# Altium schematic sheet 海关全向控制器主控板电路V3_系统管理.SchDoc
size A4
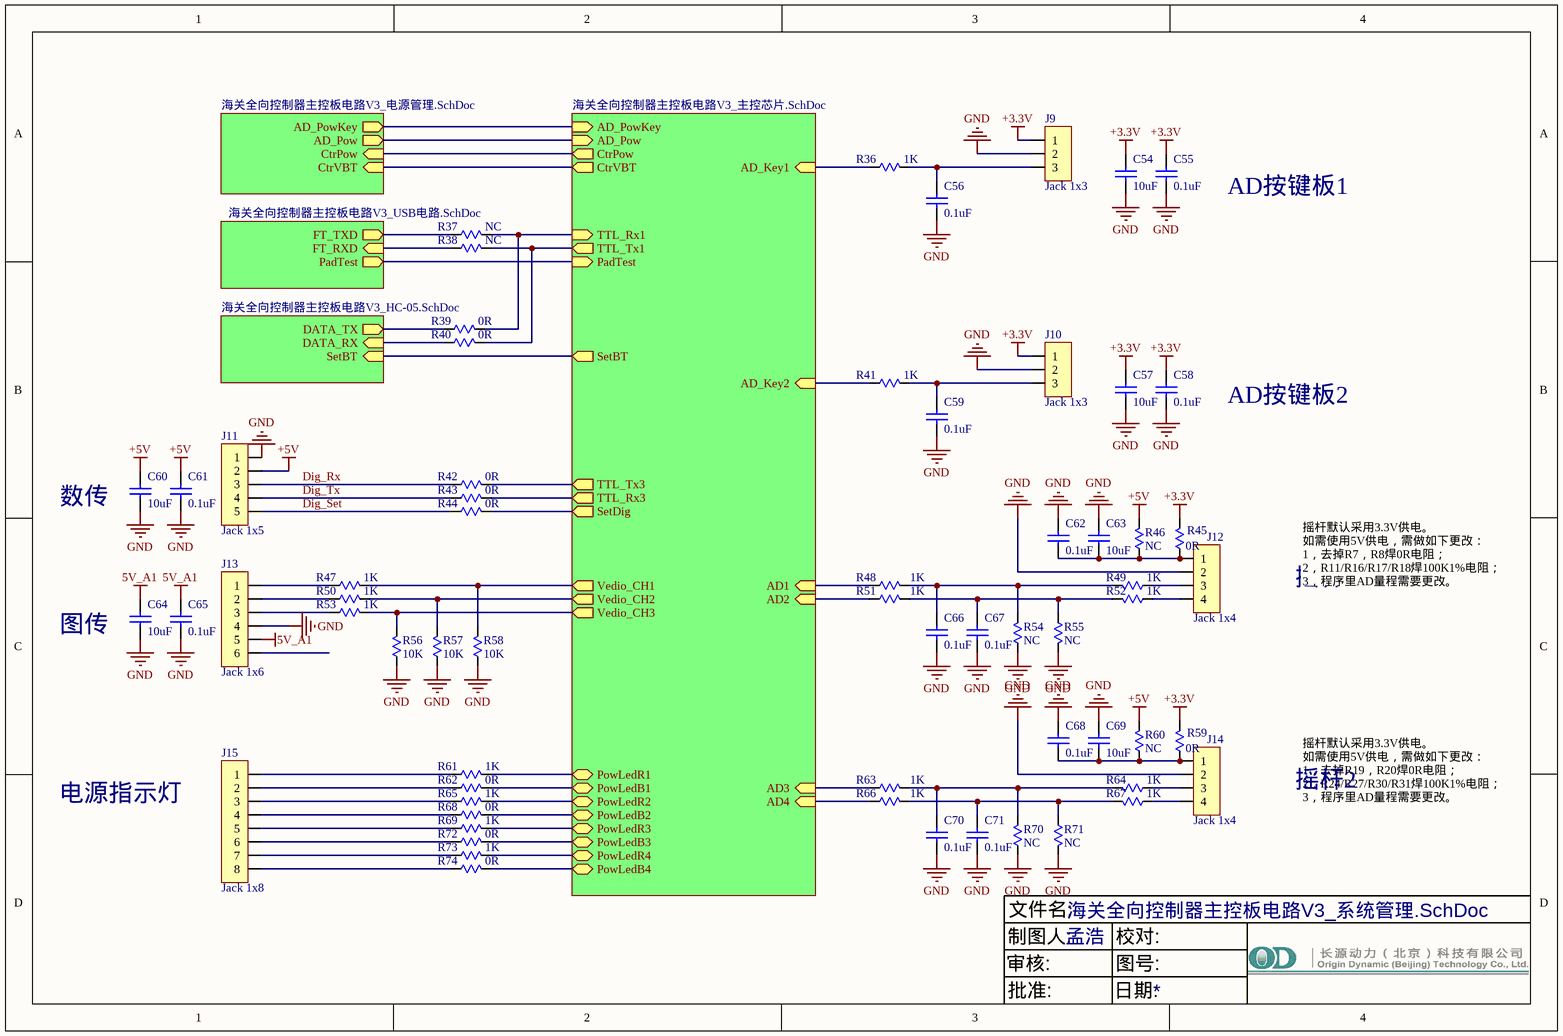
[diagram p0: 海关全向控制器主控板电路V3_系统管理.SchDoc]

## Parts
C54  10uF  [C0805]
C55  0.1uF  [C0805]
C56  0.1uF  [C0805]
C57  10uF  [C0805]
C58  0.1uF  [C0805]
C59  0.1uF  [C0805]
C60  10uF  [C0805]
C61  0.1uF  [C0805]
C62  0.1uF  [C0805]
C63  10uF  [C0805]
C64  10uF  [C0805]
C65  0.1uF  [C0805]
C66  0.1uF  [C0805]
C67  0.1uF  [C0805]
C68  0.1uF  [C0805]
C69  10uF  [C0805]
C70  0.1uF  [C0805]
C71  0.1uF  [C0805]
J9  Jack 1x3  [ZH-3AWD]
J10  Jack 1x3  [ZH-3AWD]
J11  Jack 1x5  [ZH-5AWD]
J12  Jack 1x4  [ZH-4AWD]
J13  Jack 1x6  [ZH-6AWD]
J14  Jack 1x4  [ZH-4AWD]
J15  Jack 1x8  [ZH-8AWD]
R36  1K  [R0805]
R37  NC  [R0805]
R38  NC  [R0805]
R39  0R  [R0805]
R40  0R  [R0805]
R41  1K  [R0805]
R42  0R  [R0805]
R43  0R  [R0805]
R44  0R  [R0805]
R45  0R  [R0805]
R46  NC  [R0805]
R47  1K  [R0805]
R48  1K  [R0805]
R49  1K  [R0805]
R50  1K  [R0805]
R51  1K  [R0805]
R52  1K  [R0805]
R53  1K  [R0805]
R54  NC  [R0805]
R55  NC  [R0805]
R56  10K  [R0805]
R57  10K  [R0805]
R58  10K  [R0805]
R59  0R  [R0805]
R60  NC  [R0805]
R61  1K  [R0805]
R62  0R  [R0805]
R63  1K  [R0805]
R64  1K  [R0805]
R65  1K  [R0805]
R66  1K  [R0805]
R67  1K  [R0805]
R68  0R  [R0805]
R69  1K  [R0805]
R70  NC  [R0805]
R71  NC  [R0805]
R72  0R  [R0805]
R73  1K  [R0805]
R74  0R  [R0805]

## Sub-sheets
Designator = 海关全向控制器主控板电路V3_电源管理.SchDoc: AD_PowKey (out), AD_Pow (out), CtrPow (in), CtrVBT (in)
Designator = 海关全向控制器主控板电路V3_USB电路.SchDoc: FT_RXD (in), FT_TXD (out), PadTest (out)
Designator = 海关全向控制器主控板电路V3_主控芯片.SchDoc: AD_PowKey (in), AD_Pow (in), CtrPow (out), TTL_Rx1 (in), TTL_Tx1 (out), AD_Key1 (in), AD1 (in), AD2 (in), AD3 (in), AD4 (in), TTL_Tx3 (out), TTL_Rx3 (out), Vedio_CH1 (out), Vedio_CH2 (out), Vedio_CH3 (out), AD_Key2 (in), PowLedR1 (bidir), PowLedR2 (bidir), PowLedR3 (bidir), PowLedB1 (bidir), PowLedB2 (bidir), PowLedB3 (bidir), SetDig (out), PowLedR4 (bidir), PowLedB4 (bidir), SetBT (out), PadTest (in), CtrVBT (out)
Designator = 海关全向控制器主控板电路V3_HC-05.SchDoc: DATA_RX (in), DATA_TX (out), SetBT (in)

## Nets
5V_A1: C64.1 C65.1 J13.5
+3.3V: C54.1 C55.1 C57.1 C58.1 J9.1 J10.1 R45.1 R59.1
+5V: C60.1 C61.1 J11.2 R46.1 R60.1
GND: C54.2 C55.2 C56.2 C57.2 C58.2 C59.2 C60.2 C61.2 C62.1 C63.1 C64.2 C65.2 C66.2 C67.2 C68.1 C69.1 C70.2 C71.2 J9.2 J10.2 J11.1 J12.2 J13.4 J14.2 R54.2 R55.1 R56.1 R57.1 R58.1 R70.2 R71.1
Dig_Rx: J11.3 R42.1
Dig_Set: J11.5 R44.1
Dig_Tx: J11.4 R43.1
NetC56_1: C56.1 J9.3 R36.2
NetC59_1: C59.1 J10.3 R41.2
NetC62_2: C62.2 C63.2 J12.1 R45.2 R46.2
NetC66_1: C66.1 R48.1 R49.1 R54.1
NetC67_1: C67.1 R51.1 R52.1 R55.2
NetC68_2: C68.2 C69.2 J14.1 R59.2 R60.2
NetC70_1: C70.1 R63.1 R64.1 R70.1
NetC71_1: C71.1 R66.1 R67.1 R71.2
NetJ12_3: J12.3 R49.2
NetJ12_4: J12.4 R52.2
NetJ13_1: J13.1 R47.1
NetJ13_2: J13.2 R50.1
NetJ13_3: J13.3 R53.1
NetJ14_3: J14.3 R64.2
NetJ14_4: J14.4 R67.2
NetJ15_1: J15.1 R61.1
NetJ15_2: J15.2 R62.1
NetJ15_3: J15.3 R65.1
NetJ15_4: J15.4 R68.1
NetJ15_5: J15.5 R69.1
NetJ15_6: J15.6 R72.1
NetJ15_7: J15.7 R73.1
NetJ15_8: J15.8 R74.1
NetR36_1: R36.1 ; sheet Designator/AD_Key1
NetR37_1: R37.1 R39.1 ; sheet Designator/TTL_Rx1
NetR37_2: R37.2 ; sheet Designator/FT_TXD
NetR38_1: R38.1 R40.1 ; sheet Designator/TTL_Tx1
NetR38_2: R38.2 ; sheet Designator/FT_RXD
NetR39_2: R39.2 ; sheet Designator/DATA_TX
NetR40_2: R40.2 ; sheet Designator/DATA_RX
NetR41_1: R41.1 ; sheet Designator/AD_Key2
NetR42_2: R42.2 ; sheet Designator/TTL_Tx3
NetR43_2: R43.2 ; sheet Designator/TTL_Rx3
NetR44_2: R44.2 ; sheet Designator/SetDig
NetR47_2: R47.2 R58.2 ; sheet Designator/Vedio_CH1
NetR48_2: R48.2 ; sheet Designator/AD1
NetR50_2: R50.2 R57.2 ; sheet Designator/Vedio_CH2
NetR51_2: R51.2 ; sheet Designator/AD2
NetR53_2: R53.2 R56.2 ; sheet Designator/Vedio_CH3
NetR61_2: R61.2 ; sheet Designator/PowLedR1
NetR62_2: R62.2 ; sheet Designator/PowLedB1
NetR63_2: R63.2 ; sheet Designator/AD3
NetR65_2: R65.2 ; sheet Designator/PowLedR2
NetR66_2: R66.2 ; sheet Designator/AD4
NetR68_2: R68.2 ; sheet Designator/PowLedB2
NetR69_2: R69.2 ; sheet Designator/PowLedR3
NetR72_2: R72.2 ; sheet Designator/PowLedB3
NetR73_2: R73.2 ; sheet Designator/PowLedR4
NetR74_2: R74.2 ; sheet Designator/PowLedB4
(unnamed): sheet Designator/AD_PowKey, sheet Designator/AD_PowKey
(unnamed): sheet Designator/AD_Pow, sheet Designator/AD_Pow
(unnamed): sheet Designator/CtrPow, sheet Designator/CtrPow
(unnamed): sheet Designator/CtrVBT, sheet Designator/CtrVBT
(unnamed): sheet Designator/PadTest, sheet Designator/PadTest
(unnamed): sheet Designator/SetBT, sheet Designator/SetBT

Not connected (* = marked no-connect by the designer): J13 6

## Notes on the sheet
- AD按键板1
- AD按键板2
- 数传
- 摇杆默认采用3.3V供电。
  如需使用5V供电，需做如下更改：
  1，去掉R7，R8焊0R电阻；
  2，R11/R16/R17/R18焊100K1%电阻；
  3，程序里AD量程需要更改。
- 图传
- 摇杆1
- 摇杆2
- 电源指示灯
- 摇杆默认采用3.3V供电。
  如需使用5V供电，需做如下更改：
  1，去掉R19，R20焊0R电阻；
  2，R24/R27/R30/R31焊100K1%电阻；
  3，程序里AD量程需要更改。
- 文件名:
- 审核:
- 制图人:
- 孟浩
- 校对:
- 图号:
- 批准:
- 日期:

## Library data of the parts
C54-C71 = Cap: Capacitor; Published: 8-Jun-2000; Revision: July-2002: Re-released for DXP Platform.; Publisher: Altium Limited
  C54 C57 C60 C63 C64 C69: Value: 10uF
  C55 C56 C58 C59 C61 C62 C65-C68 C70 C71: Value: 0.1uF
J9 J10 = Jack 1x3: 插座
J11 = Jack 1x5: 插座
J12 J14 = Jack 1x4: 插座
J13 = Jack 1x6: 插座
J15 = Jack 1x8: 插座
R36-R74 = Res: Resistor; Published: 8-Jun-2000; LatestRevisionDate: 04-Mar-2005; LatestRevisionNote: PCB Footprint replaced.; PackageReference: J1-0603; Publisher: Altium Limited
  R36 R41 R47-R53 R63 R64 R66 R67: Value: 1K
  R37 R38 R46 R54 R55 R60 R70 R71: Value: NC
  R39 R40 R42-R45 R59 R62 R68 R72 R74: Value: 0R
  R56-R58: Value: 10K